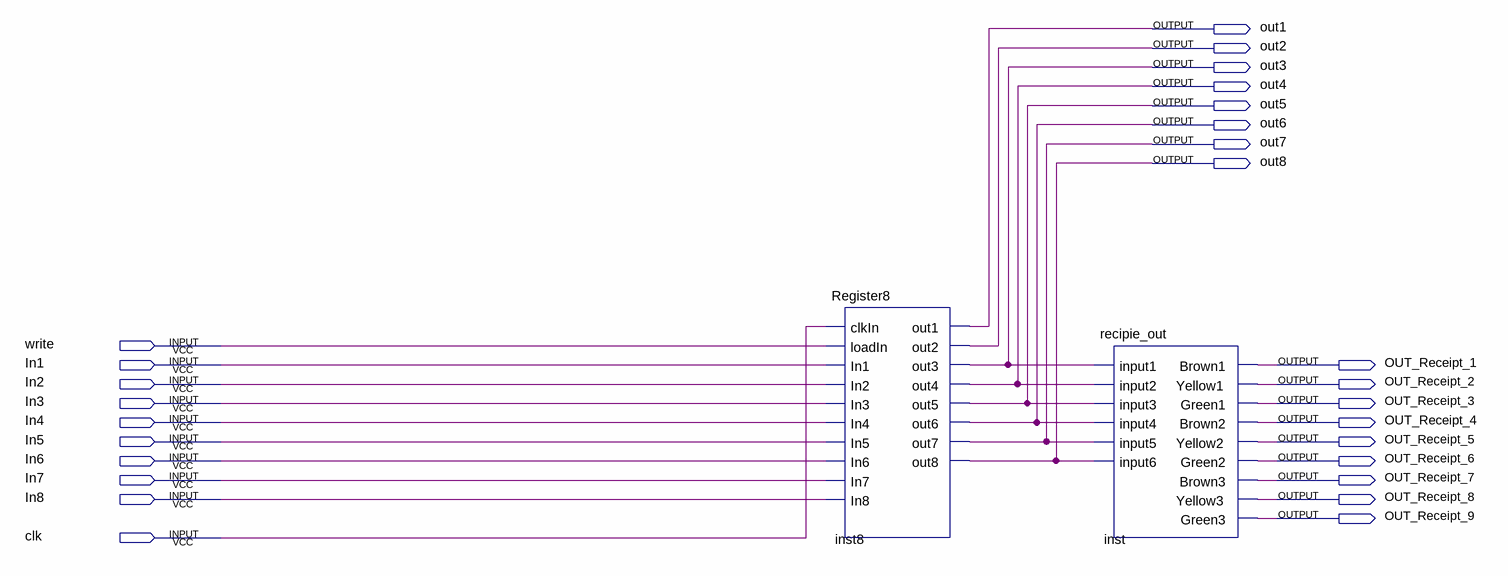
[diagram p0: schematic sheet]
// Quartus schematic OUTPUT_receipt.bdf as structural Verilog: 2 symbols, 27 pins
module OUTPUT_receipt (
  input  write,
  input  In1,
  input  In2,
  input  In3,
  input  In4,
  input  In5,
  input  In6,
  input  In7,
  input  In8,
  input  clk,
  output out1,
  output out2,
  output out3,
  output out4,
  output out5,
  output out6,
  output out7,
  output out8,
  output OUT_Receipt_1,
  output OUT_Receipt_2,
  output OUT_Receipt_3,
  output OUT_Receipt_4,
  output OUT_Receipt_5,
  output OUT_Receipt_6,
  output OUT_Receipt_7,
  output OUT_Receipt_8,
  output OUT_Receipt_9
);

  Register8 inst8 (
    .clkIn(clk), .loadIn(write), .In1(In1), .In2(In2), .In3(In3), .In4(In4), .In5(In5), .In6(In6), .In7(In7),
    .In8(In8), .out1(out1), .out2(out2), .out3(out3), .out4(out4), .out5(out5), .out6(out6), .out7(out7),
    .out8(out8));
  recipie_out inst (
    .input1(out3), .input2(out4), .input3(out5), .input4(out6), .input5(out7), .input6(out8),
    .Brown1(OUT_Receipt_1), .Yellow1(OUT_Receipt_2), .Green1(OUT_Receipt_3), .Brown2(OUT_Receipt_4),
    .Yellow2(OUT_Receipt_5), .Green2(OUT_Receipt_6), .Brown3(OUT_Receipt_7), .Yellow3(OUT_Receipt_8),
    .Green3(OUT_Receipt_9));
endmodule
